# Altium project UART_Component.PrjPcb
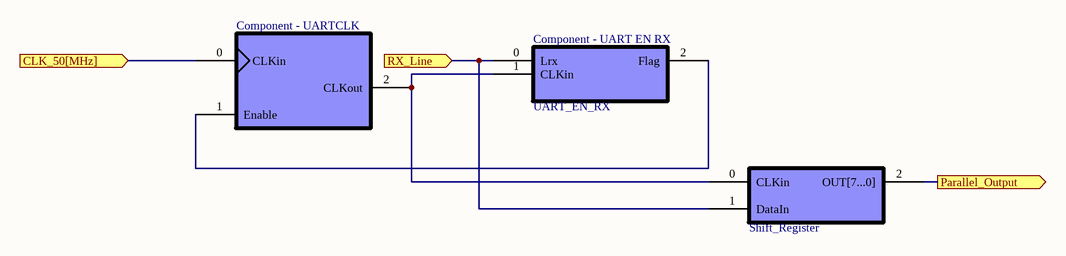
[diagram p0: Sheet1.SchDoc]
1 sheet, 3 parts. Net scope: flat (ports and power ports of the same name join across sheets).

## Sheet Sheet1.SchDoc
size A4; SheetNumber: 1; SheetTotal: 1

### Parts
(Parts that share a designator on the sheet are numbered #1, #2 ... from top to bottom, then left to right.)
*#1  UART_CLK  (value not drawn)
*#2  UART_EN_RX
*#3  Shift_Register

### Ports
CLK_50[MHz] (in), Parallel_Output (out), RX_Line (in)

### Nets
Net*#1_0: *#1.0(CLKin) ; port CLK_50[MHz]
Net*#1_1: *#1.1(Enable) *#2.2(Flag)
Net*#1_2: *#1.2(CLKout) *#2.1(CLKin) *#3.0(CLKin)
Net*#2_0: *#2.0(Lrx) *#3.1(DataIn) ; port RX_Line
Net*#3_2: *#3.2(OUT[7...0]) ; port Parallel_Output

### Notes on the sheet
- (in symbol UART_CLK) Component - UARTCLK
- (in symbol UART_EN_RX) Component - UART EN RX